# Altium schematic sheet BYPASS_CAP.SchDoc
size A0
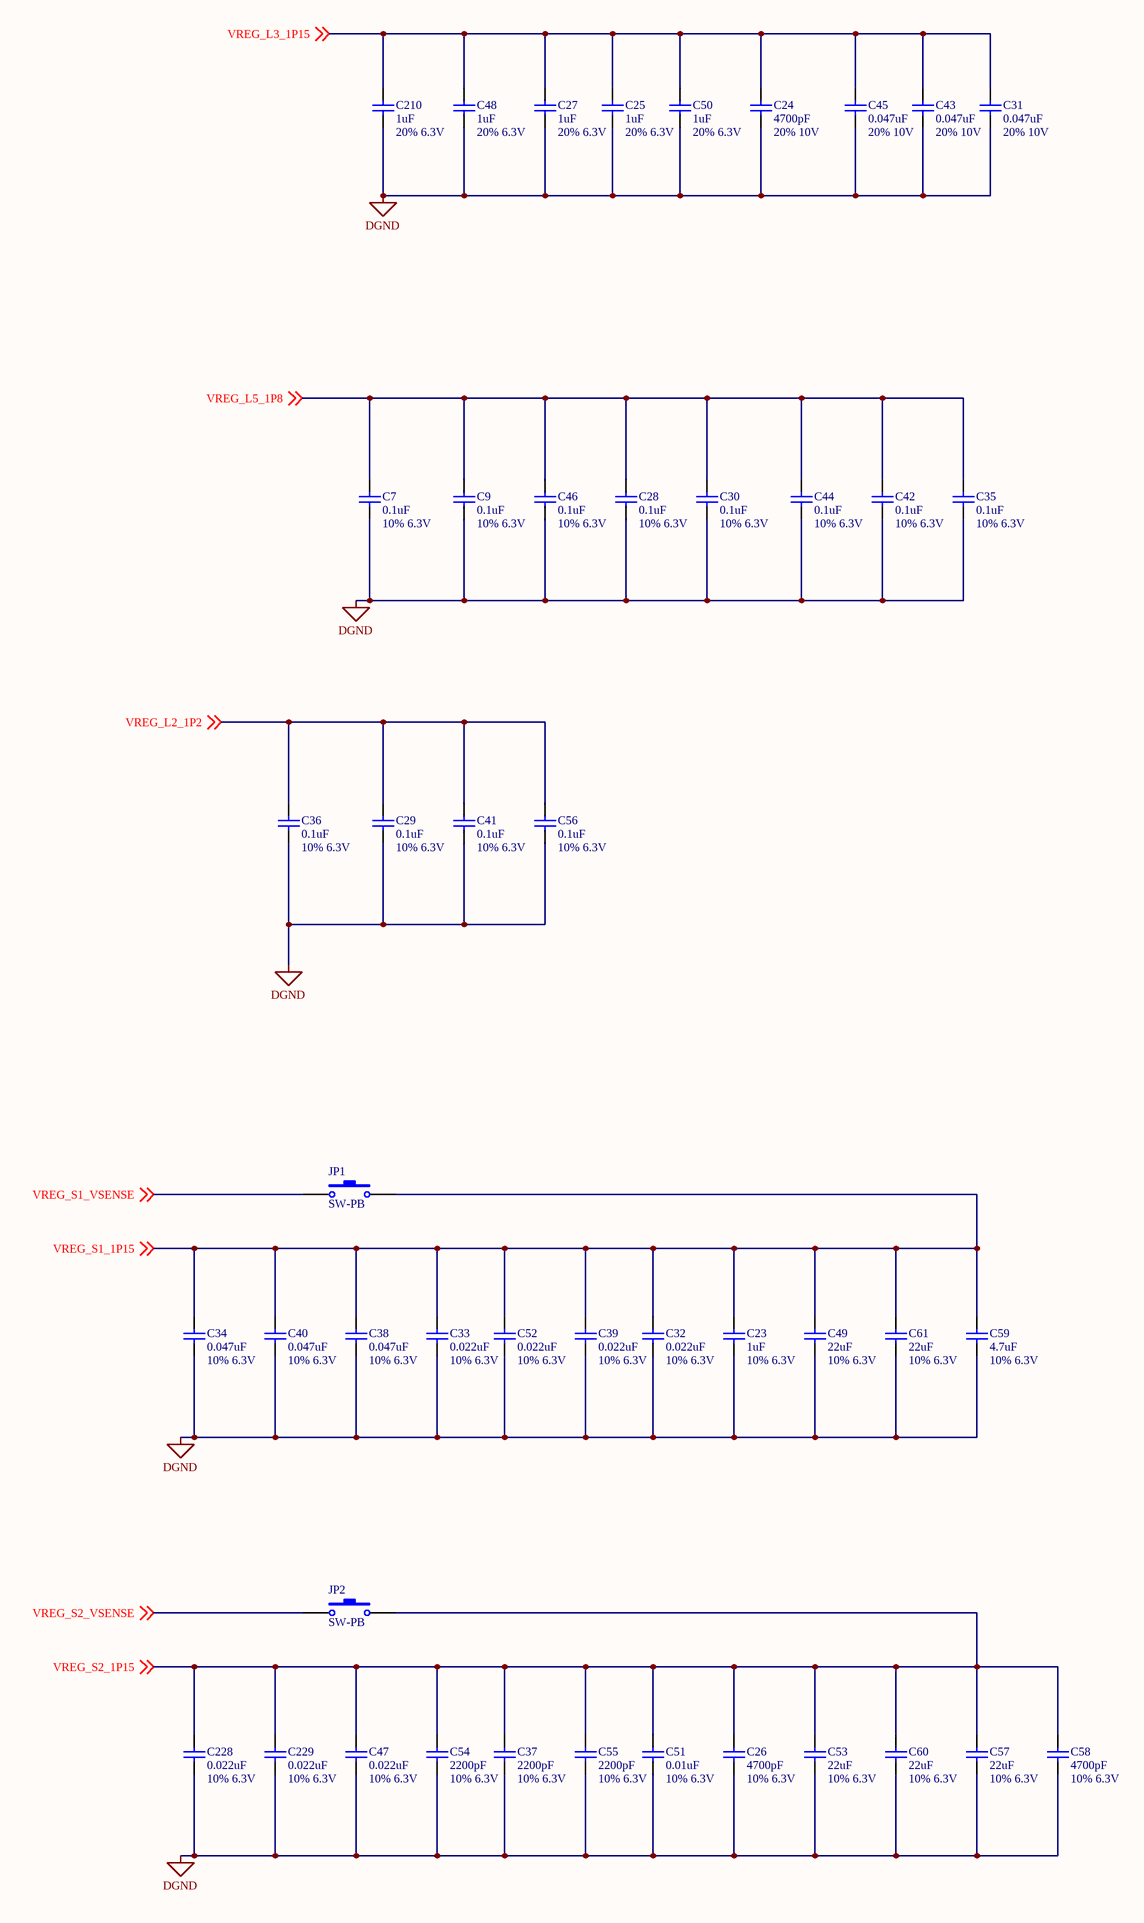
[diagram p0: BYPASS_CAP.SchDoc]

## Parts
C7  0.1uF  value 10% 6.3V  [C0402]
C9  0.1uF  value 10% 6.3V  [C0402]
C23  1uF  value 10% 6.3V  [C0402]
C24  4700pF  value 20% 10V  [C0402]
C25  1uF  value 20% 6.3V  [C0402]
C26  4700pF  value 10% 6.3V  [C0402]
C27  1uF  value 20% 6.3V  [C0402]
C28  0.1uF  value 10% 6.3V  [C0402]
C29  0.1uF  value 10% 6.3V  [C0402]
C30  0.1uF  value 10% 6.3V  [C0402]
C31  0.047uF  value 20% 10V  [C0402]
C32  0.022uF  value 10% 6.3V  [C0402]
C33  0.022uF  value 10% 6.3V  [C0402]
C34  0.047uF  value 10% 6.3V  [C0402]
C35  0.1uF  value 10% 6.3V  [C0402]
C36  0.1uF  value 10% 6.3V  [C0402]
C37  2200pF  value 10% 6.3V  [C0402]
C38  0.047uF  value 10% 6.3V  [C0402]
C39  0.022uF  value 10% 6.3V  [C0402]
C40  0.047uF  value 10% 6.3V  [C0402]
C41  0.1uF  value 10% 6.3V  [C0402]
C42  0.1uF  value 10% 6.3V  [C0402]
C43  0.047uF  value 20% 10V  [C0402]
C44  0.1uF  value 10% 6.3V  [C0402]
C45  0.047uF  value 20% 10V  [C0402]
C46  0.1uF  value 10% 6.3V  [C0402]
C47  0.022uF  value 10% 6.3V  [C0402]
C48  1uF  value 20% 6.3V  [C0402]
C49  22uF  value 10% 6.3V  [C0402]
C50  1uF  value 20% 6.3V  [C0402]
C51  0.01uF  value 10% 6.3V  [C0402]
C52  0.022uF  value 10% 6.3V  [C0402]
C53  22uF  value 10% 6.3V  [C0402]
C54  2200pF  value 10% 6.3V  [C0402]
C55  2200pF  value 10% 6.3V  [C0402]
C56  0.1uF  value 10% 6.3V  [C0402]
C57  22uF  value 10% 6.3V  [C0402]
C58  4700pF  value 10% 6.3V  [C0402]
C59  4.7uF  value 10% 6.3V  [C0402]
C60  22uF  value 10% 6.3V  [C0402]
C61  22uF  value 10% 6.3V  [C0402]
C210  1uF  value 20% 6.3V  [C0402]
C228  0.022uF  value 10% 6.3V  [C0402]
C229  0.022uF  value 10% 6.3V  [C0402]
JP1  SW-PB  [SPST-2]
JP2  SW-PB  [SPST-2]

## Nets
DGND: C7.1 C9.1 C23.1 C24.1 C25.1 C26.1 C27.1 C28.1 C29.1 C30.1 C31.1 C32.1 C33.1 C34.1 C35.1 C36.1 C37.1 C38.1 C39.1 C40.1 C41.1 C42.1 C43.1 C44.1 C45.1 C46.1 C47.1 C48.1 C49.1 C50.1 C51.1 C52.1 C53.1 C54.1 C55.1 C56.1 C57.1 C58.1 C59.1 C60.1 C61.1 C210.1 C228.1 C229.1
VREG_L2_1P2: C29.2 C36.2 C41.2 C56.2 ; off-sheet VREG_L2_1P2
VREG_L3_1P15: C24.2 C25.2 C27.2 C31.2 C43.2 C45.2 C48.2 C50.2 C210.2 ; off-sheet VREG_L3_1P15
VREG_L5_1P8: C7.2 C9.2 C28.2 C30.2 C35.2 C42.2 C44.2 C46.2 ; off-sheet VREG_L5_1P8
VREG_S1_1P15: C23.2 C32.2 C33.2 C34.2 C38.2 C39.2 C40.2 C49.2 C52.2 C59.2 C61.2 JP1.2 ; off-sheet VREG_S1_1P15
VREG_S1_VSENSE: JP1.1 ; off-sheet VREG_S1_VSENSE
VREG_S2_1P15: C26.2 C37.2 C47.2 C51.2 C53.2 C54.2 C55.2 C57.2 C58.2 C60.2 C228.2 C229.2 JP2.2 ; off-sheet VREG_S2_1P15
VREG_S2_VSENSE: JP2.1 ; off-sheet VREG_S2_VSENSE

## Library data of the parts
C7 C9 C23-C61 C210 C228 C229 = Cap: Capacitor; Published: 8-Jun-2000; LatestRevisionDate: 17-Jul-2002; LatestRevisionNote: Re-released for DXP Platform.; PackageReference: RAD-0.3; Publisher: Altium Limited; PackageDescription: Radial Cap, Thru-Hole; 2 Leads; 0.3 in Pin Spacing
JP1 JP2 = SW-PB: Switch; Published: 24-Mar-1999; LatestRevisionDate: 17-Jul-2002; LatestRevisionNote: Re-released for DXP Platform.; PackageReference: SPST-2; Publisher: Altium Limited; PackageDescription: Switch; 2 Leads